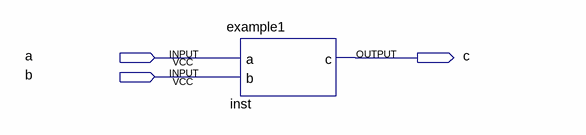
[diagram p0: schematic sheet]
// Quartus schematic top.bdf as structural Verilog: 1 symbols, 3 pins
module top (
  input  a,
  input  b,
  output c
);

  example1 inst (.a(a), .b(b), .c(c));
endmodule
